# EAGLE design Touch.Cat.0.3 (EAGLE 9.3.1)
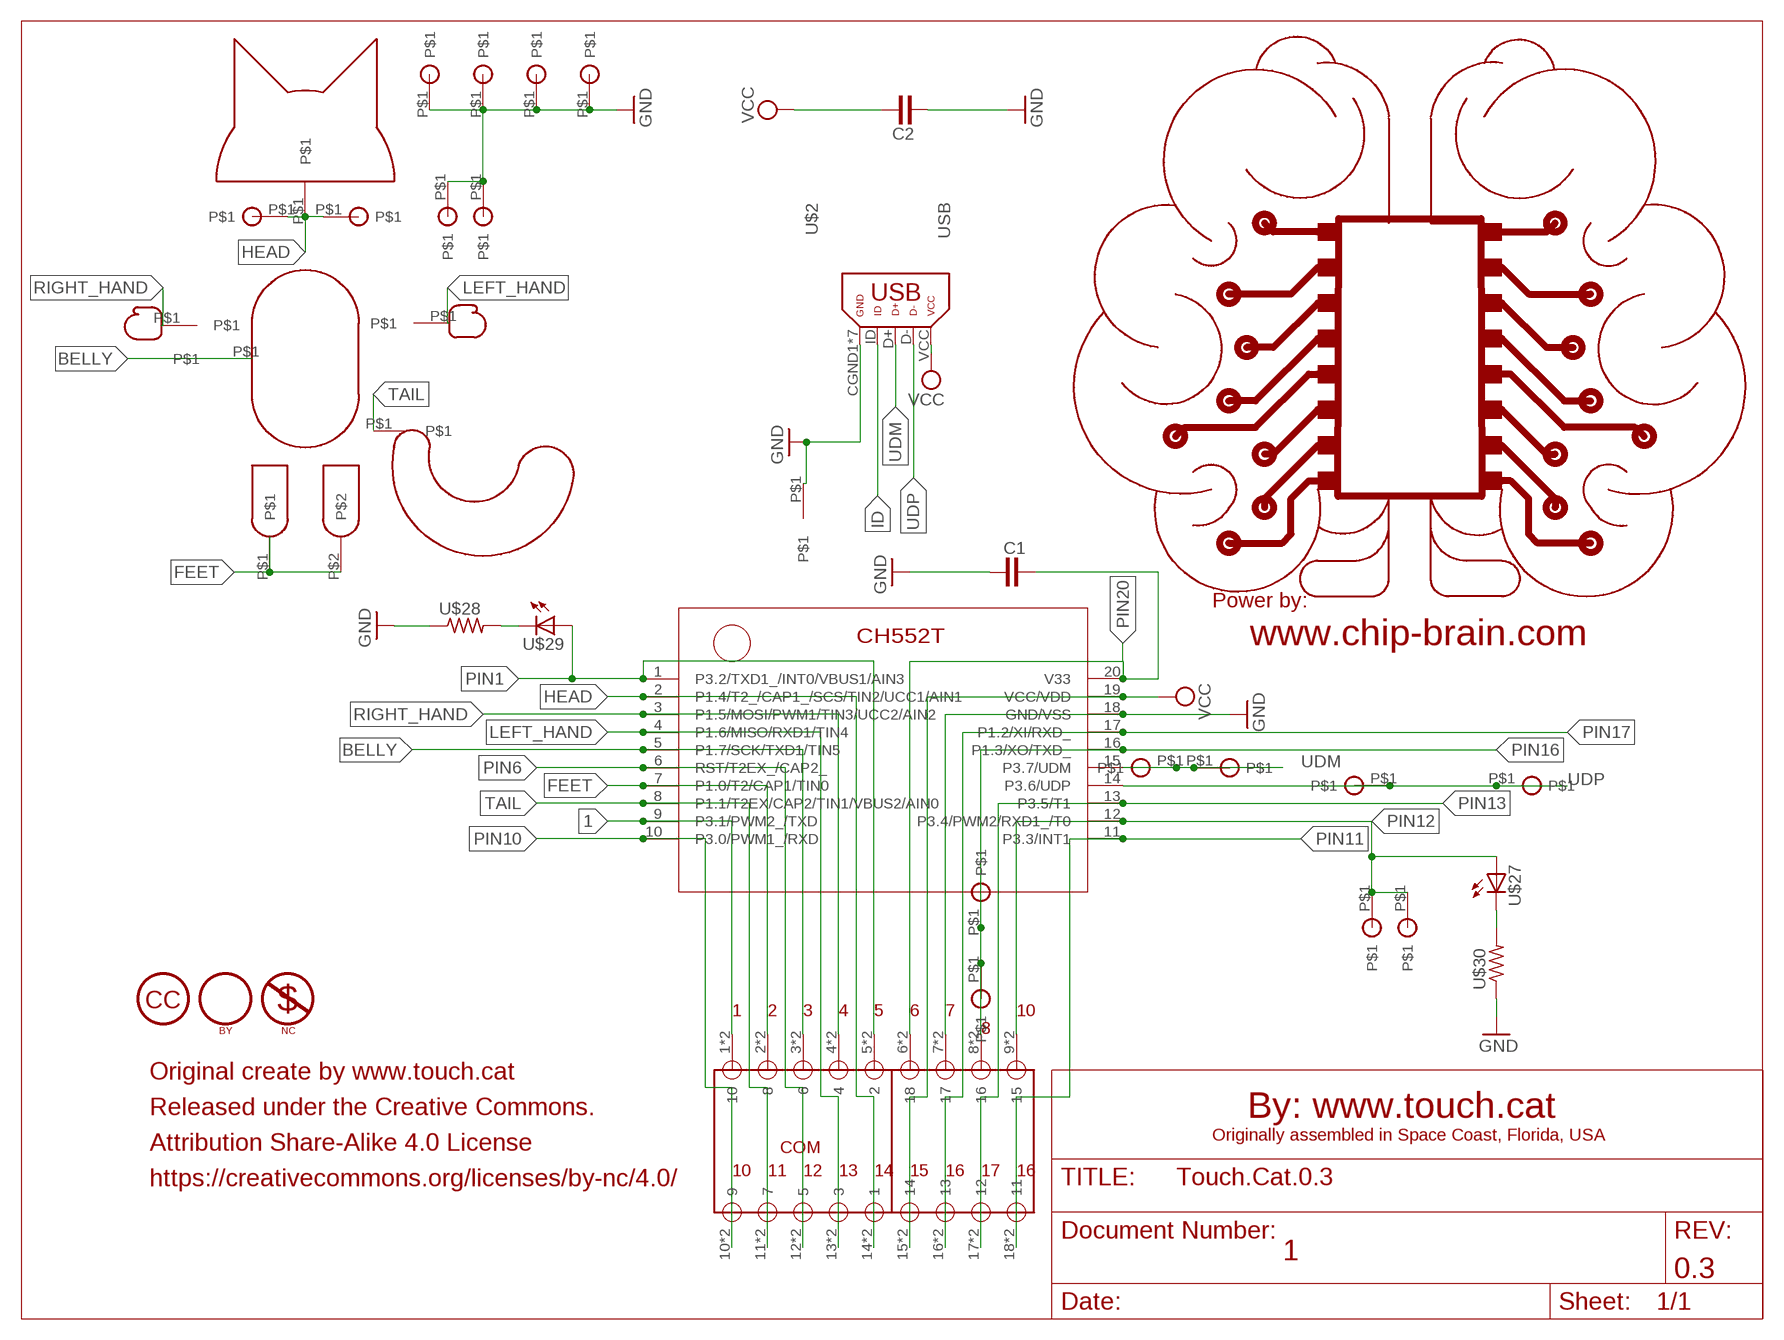
[diagram p0: schematic, sheet 1]

## Parts
C1  CAPACITOR  [C0402]
C2  CAPACITOR  [C0402]
U$1  CHIP-TOUCH-CAT  [TSSOP20]
U$2  USB  [GHI-CONNECTORS_10118192-0001LF(MICRO-USB-B-AMPHENOL-FCI)]
U$3  PADVIA  [PADVIA]
U$4  COM-TOUCH-CAT  [COM]
U$5  PADVIA  [PADVIA]
U$6  PADVIA  [PADVIA]
U$7  PADVIA  [PADVIA]
U$8  PADVIA  [PADVIA]
U$9  PADVIA  [PADVIA]
U$11  PADVIA  [PADVIA]
U$12  PADVIA  [PADVIA]
U$13  PADVIA  [PADVIA]
U$14  PADVIA  [PADVIA]
U$15  PADVIA  [PADVIA]
U$16  PADVIA  [PADVIA]
U$17  HEAD-TOUCH-CAT  [HEAD-TOUCH-CAT]
U$18  BELLY-TOUCH-CAT  [BELLY-TOUCH-CAT]
U$19  RIGHT_HAND-TOUCH-CAT  [RIGHT_HAND-TOUCH-CAT]
U$20  LEFT_HAND-TOUCH-CAT  [LEFT_HAND-TOUCH-CAT]
U$21  FEET-TOUCH-CAT  [FEET-TOUCH-CAT]
U$22  TAIL-TOUCH-CAT  [TAIL-TOUCH-CAT]
U$23  PADVIA  [PADVIA]
U$24  PADVIA  [PADVIA]
U$25  PADVIA  [PADVIA]
U$26  PADVIA  [PADVIA]
U$27  LED-TOUCH-CAT  [0603-ORANGE]
U$28  RESISTOR-TOUCH-CAT  [R0402]
U$29  LED-TOUCH-CAT  [0603-ORANGE]
U$30  RESISTOR-TOUCH-CAT  [R0402]
U$31  OSHW-LOGO  [OSHW-LOGO-MINI]
U$32  CHIP-BRAIN  [CHIP-BRAIN]

## Nets
1: U$1.9(P3.1/PWM2_/TXD) U$4.1 U$4.1.1
BELLY: U$1.5(P1.7/SCK/TXD1/TIN5) U$4.3 U$4.3.1 U$18.P$1
FEET: U$1.7(P1.0/T2/CAP1/TIN0) U$4.2 U$4.2.1 U$21.P$1 U$21.P$2
GND: C1.1 C2.1 U$1.18(GND/VSS) U$2.CGND1(GND) U$2.CGND2(GND) U$2.CGND3(GND) U$2.CGND4(GND) U$2.CGND5(GND) U$2.CGND6(GND) U$2.GND U$4.7 U$4.7.1 U$6.P$1 U$7.P$1 U$23.P$1 U$24.P$1 U$25.P$1 U$26.P$1 U$28.1 U$30.1 U$31.P$1
HEAD: U$1.2(P1.4/T2_/CAP1_/SCS/TIN2/UCC1/AIN1) U$4.14 U$4.14.1 U$8.P$1 U$9.P$1 U$17.P$1
ID: U$2.ID
LEFT_HAND: U$1.4(P1.6/MISO/RXD1/TIN4) U$4.13 U$4.13.1 U$20.P$1
N$2: U$27.C U$30.2
N$19: U$28.2 U$29.C
PIN1: U$1.1(P3.2/TXD1_/INT0/VBUS1/AIN3) U$4.5 U$4.5.1 U$29.A
PIN6: U$1.6(RST/T2EX_/CAP2_) U$4.12 U$4.12.1
PIN10: U$1.10(P3.0/PWM1_/RXD) U$4.10 U$4.10.1
PIN11: U$1.11(P3.3/INT1) U$4.18 U$4.18.1
PIN12: U$1.12(P3.4/PWM2/RXD1_/T0) U$3.P$1 U$4.9 U$4.9.1 U$5.P$1 U$27.A
PIN13: U$1.13(P3.5/T1) U$4.17 U$4.17.1
PIN16: U$1.16(P1.3/XO/TXD_) U$4.8 U$4.8.1 U$11.P$1 U$12.P$1
PIN17: U$1.17(P1.2/XI/RXD_) U$4.16 U$4.16.1
PIN20: C1.2 U$1.20(V33) U$4.6 U$4.6.1
RIGHT_HAND: U$1.3(P1.5/MOSI/PWM1/TIN3/UCC2/AIN2) U$4.4 U$4.4.1 U$19.P$1
TAIL: U$1.8(P1.1/T2EX/CAP2/TIN1/VBUS2/AIN0) U$4.11 U$4.11.1 U$22.P$1
UDM: U$1.15(P3.7/UDM) U$2.D+ U$13.P$1 U$14.P$1
UDP: U$1.14(P3.6/UDP) U$2.D- U$15.P$1 U$16.P$1
VCC: C2.2 U$1.19(VCC/VDD) U$2.VCC U$4.15 U$4.15.1

## Notes on the sheet
- Power by:
- CC | 🕴 | $
- 1 | 2 | 3 | 4 | 5 | 6 | 7 | 10
- BY | NC | 8
- Original create by www.touch.cat
- Released under the Creative Commons. | By: www.touch.cat | 🚀
- Originally assembled in Space Coast, Florida, USA | 🏝
- Attribution Share-Alike 4.0 License
- 10 | 11 | 12 | 13 | 14 | 15 | 16 | 17 | 16
- https://creativecommons.org/licenses/by-nc/4.0/
- 1
- 0.3

## Library data of the parts
C1 C2 = Touch:CAPACITOR
U$1 = Touch-cat:CHIP-TOUCH-CAT: Copyrights: www.chip-brain.com If modified stay original creator www.chip-brain.com
U$2 = chip-brain:USB: chip-brain.com Copyrights: chip-brain.com If modified stay original creator chip-brain.com
U$3 U$5-U$9 U$11-U$16 U$23-U$26 = Touch-cat:PADVIA: PAD VIA - Touch Cat Copyrights: www.touch.cat If modified stay original creator www.touch.cat
U$4 = Touch-cat:COM-TOUCH-CAT: COM - Touch Cat Copyrights: www.touch.cat If modified stay original creator www.touch.cat
U$17 = Touch-cat:HEAD-TOUCH-CAT: Head - Touch Cat Copyrights: www.touch.cat If modified stay original creator www.touch.cat
U$18 = Touch-cat:BELLY-TOUCH-CAT: Belly - Touch Cat Copyrights: www.touch.cat If modified stay original creator www.touch.cat
U$19 = Touch-cat:RIGHT_HAND-TOUCH-CAT: Right Hand - Touch Cat Copyrights: www.touch.cat If modified stay original creator www.touch.cat
U$20 = Touch-cat:LEFT_HAND-TOUCH-CAT: Left Hand - Touch Cat Copyrights: www.touch.cat If modified stay original creator www.touch.cat
U$21 = Touch-cat:FEET-TOUCH-CAT: Feet - Touch Cat Copyrights: www.touch.cat If modified stay original creator www.touch.cat
U$22 = Touch-cat:TAIL-TOUCH-CAT: TAIL - Touch Cat Copyrights: www.touch.cat If modified stay original creator www.touch.cat
U$27 U$29 = Touch-cat:LED-TOUCH-CAT: Led - Touch Cat Copyrights: www.touch.cat If modified stay original creator www.touch.cat
U$28 U$30 = Touch-cat:RESISTOR-TOUCH-CAT: Resistor - Touch Cat Copyrights: www.touch.cat If modified stay original creator www.touch.cat
U$31 = chip-brain:OSHW-LOGO
U$32 = chip-brain:CHIP-BRAIN: chip-brain.com Copyrights: chip-brain.com If modified stay original creator chip-brain.com

## Board
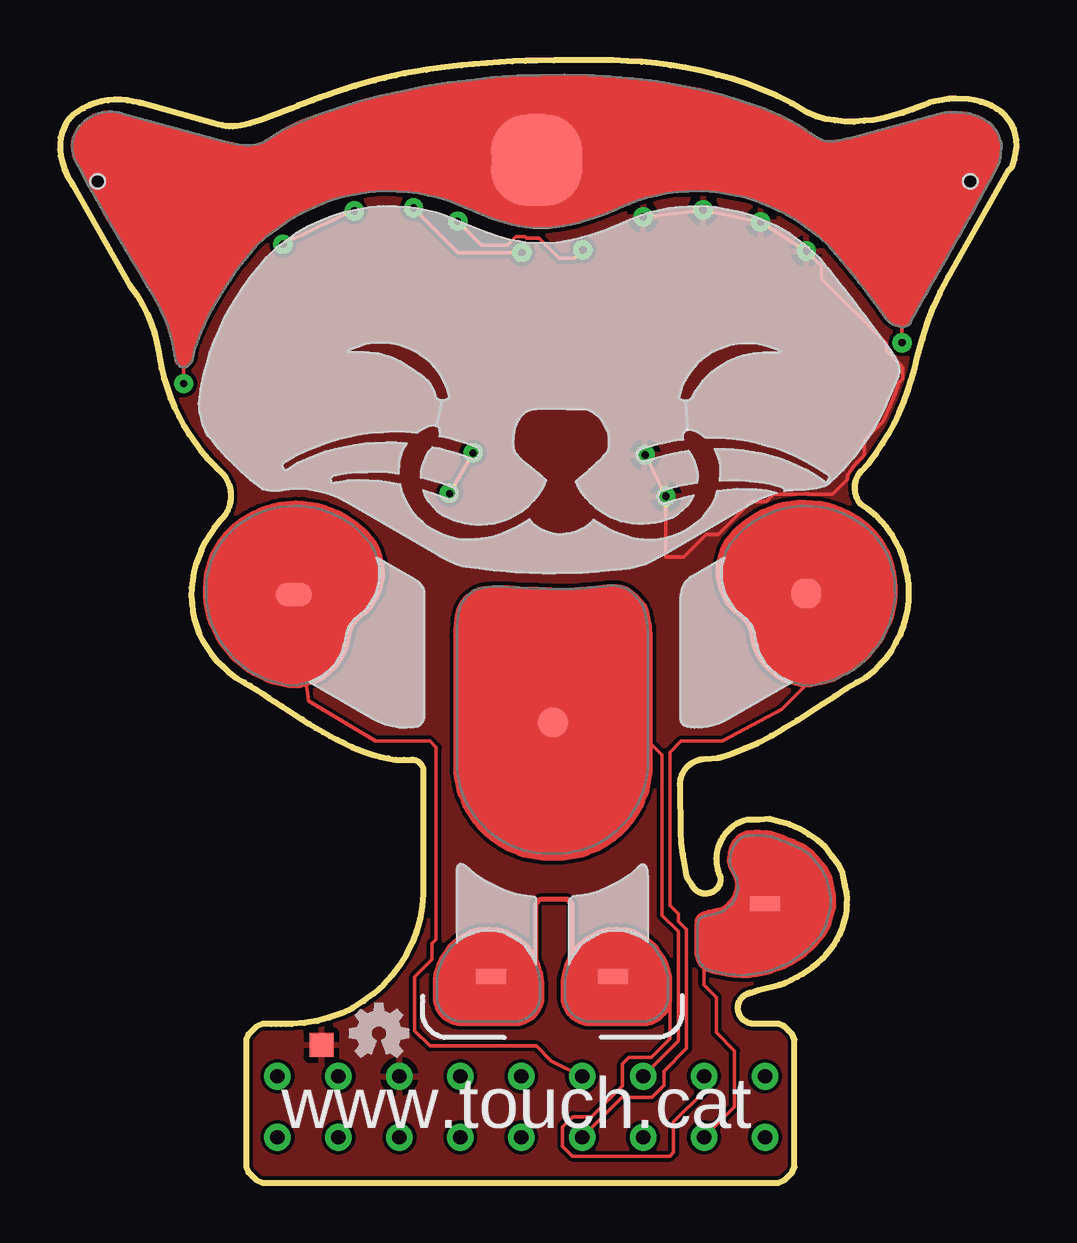
[diagram p1: board, top side]
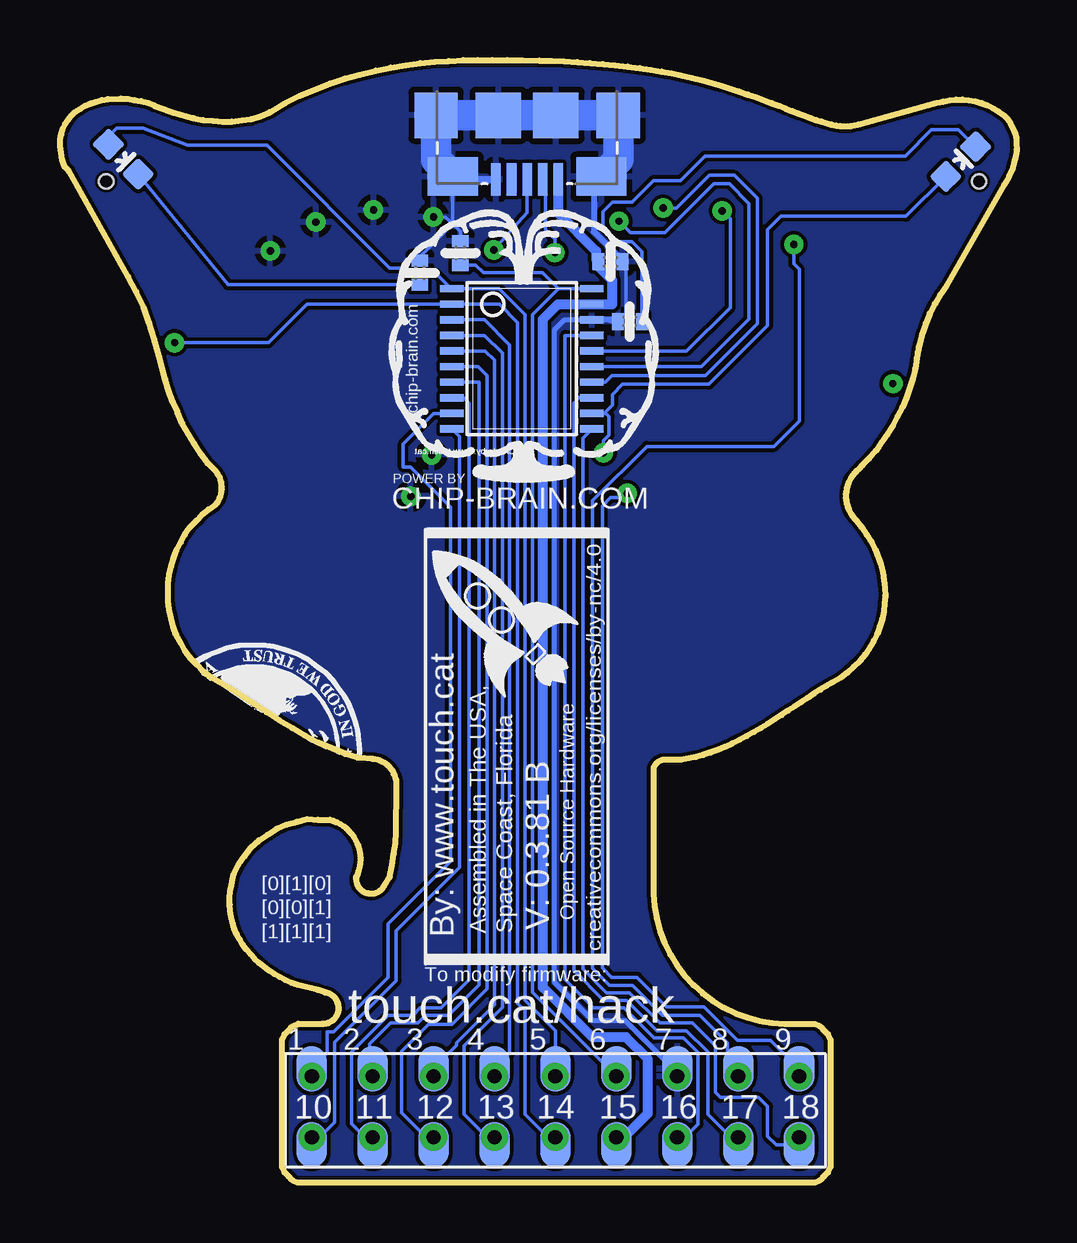
[diagram p2: board, bottom side, seen from below]

Size 39.88 x 46.8 mm. Coordinates in mm from the lower left corner, seen from the top.
Outline: 9.67,6.62 9.43,6.62 9.21,6.61 8.99,6.61 8.8,6.61 8.42,6.61 8.19,6.51 8.03,6.35 7.86,6.19 7.76,5.96 7.76,0.65 7.86,0.43 8.03,0.26 8.19,0.1 8.42,0 29.97,0 30.2,0.1 30.36,0.26 30.52,0.43 30.62,0.65 30.62,5.96 30.52,6.19 30.36,6.35 30.2,6.51 29.94,6.63 28.94,6.63 arc-176 28.84,7.93 29.14,8.03 29.99,8.25 30.24,8.34 30.49,8.44 30.72,8.57 30.95,8.7 31.17,8.84 31.38,9 31.59,9.16 31.78,9.33 31.94,9.53 32.11,9.72 32.26,9.92 32.39,10.14 32.51,10.36 32.61,10.59 32.69,10.83 32.76,11.07 32.8,11.33 32.81,11.6 32.81,11.86 32.79,12.14 32.73,12.42 32.63,12.86 32.44,13.26 32.18,13.61 31.92,13.97 31.59,14.27 31.21,14.51 30.84,14.75 30.43,14.93 30,15.04 29.57,15.16 29.14,15.13 28.64,15.13 arc102 27.54,12.73 arc-162 26.34,12.43 26.14,12.73 26.05,13.23 25.97,13.69 25.9,14.14 25.88,14.62 25.86,16.49 arc-92 26.84,17.65 27.44,17.71 27.98,17.87 28.54,18.1 29.1,18.33 29.65,18.63 30.2,18.95 30.74,19.27 31.27,19.61 31.78,19.94 32.28,20.27 32.77,20.59 33.22,20.85 33.59,21.06 33.91,21.31 34.18,21.59 34.45,21.87 34.68,22.18 34.85,22.51 35.03,22.83 35.16,23.18 35.25,23.53 35.34,23.89 35.38,24.25 35.38,24.61 35.38,24.97 35.33,25.33 35.24,25.68 35.15,26.03 35.02,26.37 34.85,26.69 34.68,27.01 34.47,27.31 34.21,27.58 33.96,27.85 33.69,28.06 33.39,28.27 arc-79 33.38,29.65 33.73,29.99 34.02,30.39 34.28,30.8 34.55,31.21 34.78,31.65 34.98,32.09 35.18,32.55 35.35,33.01 35.49,33.48 35.63,33.95 35.74,34.43 35.95,35.16 arc-15 37.03,37.75 39.53,42.17 39.69,42.35 39.79,42.65 39.84,42.93 39.88,43.21 39.87,43.46 39.82,43.69 39.77,43.92 39.67,44.13 39.54,44.3 39.4,44.48 39.24,44.63 39.04,44.76 38.84,44.88 38.62,44.98 38.38,45.05 38.13,45.12 37.87,45.16 37.33,45.19 37.06,45.17 36.78,45.13 36.5,45.08 36.22,45.01 35.95,44.9 35.55,44.74 35.14,44.6 34.33,44.38 33.92,44.3 33.52,44.26 33.11,44.22 32.71,44.23 32.31,44.28 31.91,44.34 31.51,44.45 31.12,44.62 30.51,44.99 29.89,45.3 28.64,45.81 28.01,46.02 27.38,46.18 26.71,46.35 26.08,46.48 25.47,46.57 24.85,46.66 24.26,46.72 23.66,46.75 23.07,46.79 22.47,46.8 21.85,46.79 21.23,46.79 20.59,46.78 19.91,46.77 19.39,46.76 18.86,46.74 18.32,46.71 17.79,46.67 17.25,46.63 16.74,46.57 16.22,46.52 15.72,46.46 15.26,46.38 14.8,46.31 14.37,46.24 14.01,46.15 13.55,46.05 13.12,45.94 12.31,45.71 11.92,45.59 11.56,45.48 11.2,45.36 10.86,45.23 10.54,45.12 10.22,45 9.92,44.88 9.63,44.77 9.35,44.67 9.09,44.56 8.84,44.47 8.59,44.38 8.36,44.3 8.14,44.23 7.92,44.16 7.72,44.1 7.52,44.06 arc-27 6.62,44.11 3.34,45.01 3.07,45.07 arc52 0.53,44.49 0.39,44.35 0.26,44.18 0.08,43.78 0.03,43.56 0.01,43.31 0,43.06 0.03,42.79 0.11,42.5 0.19,42.22 0.33,41.91 0.53,41.59 2.93,37.38 arc-21 3.94,35.39 4.08,34.83 4.12,34.61 4.16,34.37 4.23,33.93 4.34,33.51 4.61,32.7 4.77,32.31 4.97,31.93 5.16,31.56 5.38,31.2 5.63,30.85 5.88,30.5 6.15,30.18 6.43,29.91 6.58,29.75 arc-99 6.67,27.59 6.45,27.31 6.25,27 6.05,26.71 5.9,26.4 5.66,25.76 5.58,25.44 5.53,25.11 5.49,24.79 5.48,24.46 5.51,24.14 5.54,23.81 5.6,23.49 5.71,23.19 5.81,22.88 5.95,22.58 6.31,22.02 6.53,21.75 6.79,21.51 7.05,21.27 7.34,21.04 7.68,20.85 7.93,20.71 8.18,20.55 8.45,20.38 8.71,20.21 8.98,20.03 9.25,19.85 9.53,19.67 9.81,19.49 10.09,19.31 10.38,19.13 10.67,18.95 10.96,18.78 11.26,18.61 11.56,18.45 11.86,18.31 12.16,18.17 12.46,18.04 12.77,17.93 13.07,17.83 13.38,17.74 13.68,17.69 13.99,17.63 14.34,17.63 14.64,17.63 arc-76 15.14,17.28 15.14,12.05 arc-87 9.67,6.62
Copper layers (1*16): Top 0.035mm / dielectric 1.5mm / Bottom 0.035mm
Design rules "default *": minimum track width 6mil, minimum drill 0.35mm, track to track 6mil, track to pad 6mil, pad to pad 6mil, via to via 6mil, smd to smd 6mil, copper to edge 6mil, drill to drill 6mil, minimum pad ring 10mil, minimum via ring 8mil, stop-mask expansion 4mil, vias tented up to drill 0mil, thermal gap 10mil
Holes 0.6 mm at 1.57,41.74 37.95,41.74

### Footprints (pad centres in the part's own frame; a part is rotated, then mirrored left to right if it is on the bottom)
C0402 = smd 0.5 x 0.7: 1 -0.5,0; 2 0.5,0
TSSOP20 = smd 0.305 x 0.991: 1 -2.925,-2.918; 2 -2.275,-2.918; 3 -1.625,-2.918; 4 -0.975,-2.918; 5 -0.325,-2.918; 6 0.325,-2.918; 7 0.975,-2.918; 8 1.625,-2.918; 9 2.275,-2.918; 10 2.925,-2.918; 11 2.925,2.918; 12 2.275,2.918; 13 1.625,2.918; 14 0.975,2.918; 15 0.325,2.918; 16 -0.325,2.918; 17 -0.975,2.918; 18 -1.625,2.918; 19 -2.275,2.918; 20 -2.925,2.918
GHI-CONNECTORS_10118192-0001LF(MICRO-USB-B-AMPHENOL-FCI) = smd 1.8 x 1.9: CGND1 -3.8,0; CGND4 3.8,0 | smd 1.9 x 1.9: CGND2 -1.2,0; CGND3 1.2,0 | smd 2.1 x 1.6: CGND5 3.1,2.55; CGND6 -3.1,2.55 | smd 0.4 x 1.35: D+ 0,2.675; D- -0.65,2.675; GND 1.3,2.675; ID 0.65,2.675; VCC -1.3,2.675
PADVIA = drill 0.3: P$1 0,0
COM = drill 0.6: 1 8.89,1.27; 2 6.35,1.27; 3 3.81,1.27; 4 1.27,1.27; 5 -1.27,1.27; 6 -3.81,1.27; 7 -6.35,1.27; 8 -8.89,1.27; 9 -11.43,1.27; 10 8.89,-1.27; 11 6.35,-1.27; 12 3.81,-1.27; 13 1.27,-1.27; 14 -1.27,-1.27; 15 -3.81,-1.27; 16 -6.35,-1.27; 17 -8.89,-1.27; 18 -11.43,-1.27 | smd 1.27 x 1.905 bottom: 1.1 8.89,1.587; 2.1 6.35,1.587; 3.1 3.81,1.587; 4.1 1.27,1.587; 5.1 -1.27,1.587; 6.1 -3.81,1.587; 7.1 -6.35,1.587; 8.1 -8.89,1.587; 9.1 -11.43,1.587; 10.1 8.89,-1.587; 11.1 6.35,-1.587; 12.1 3.81,-1.587; 13.1 1.27,-1.587; 14.1 -1.27,-1.587; 15.1 -3.81,-1.587; 16.1 -6.35,-1.587; 17.1 -8.89,-1.587; 18.1 -11.43,-1.587
HEAD-TOUCH-CAT = smd 3.81 x 3.81: P$1 0,0
BELLY-TOUCH-CAT = smd 1.27 x 1.27: P$1 0,0
RIGHT_HAND-TOUCH-CAT = smd 1.5 x 1: P$1 0,0
LEFT_HAND-TOUCH-CAT = smd 1.27 x 1.27: P$1 0,0
FEET-TOUCH-CAT = smd 1.27 x 0.635: P$1 -2.54,0; P$2 2.54,0
TAIL-TOUCH-CAT = smd 1.27 x 0.635: P$1 0,0
0603-ORANGE = smd 1 x 1: A 0,-0.877; C 0,0.877
R0402 = smd 0.5 x 0.7: 1 -0.5,0; 2 0.5,0
OSHW-LOGO-MINI = smd 1 x 1: P$1 -2.4,-0.5

### Placement (x,y rotation side)
C1  23.19,38.75 270 bottom
C2  16.94,38.39 180 bottom
U$1  20.63,34.34 270 bottom
U$2  20.41,44.49 180 bottom
U$3  16.24,28.73 0 top
U$4  20.5,3.16 0 top
U$5  17.22,30.42 0 top
U$6  25.26,28.61 0 top
U$7  24.39,30.34 0 top
U$8  5.16,33.31 0 top
U$9  35.1,35.01 0 top
U$11  9.29,39.11 0 top
U$12  12.27,40.51 0 top
U$13  21.8,38.88 0 top
U$14  16.58,40.08 0 top
U$15  14.74,40.63 0 top
U$16  19.25,38.77 0 top
U$17  19.87,42.63 0 top
U$18  20.55,19.19 0 top
U$19  9.76,24.52 0 top
U$20  31.12,24.56 0 top
U$21  20.53,8.6 0 top
U$22  29.4,11.62 0 top
U$23  24.31,40.25 0 top
U$24  26.81,40.55 0 top
U$25  29.21,40.04 0 top
U$26  31.11,38.84 0 top
U$27  2.33,42.56 315 bottom
U$28  24.88,37.93 270 bottom
U$29  37.24,42.66 225 bottom
U$30  16.13,35.9 0 bottom
U$31  13.3,6.24 0 top
U$32  20.54,34.83 0 bottom

### Tracks (layer width: path | path; a pad name or v marks a point on that pad's centre or on a via)
1
  Bottom 0.152: U$1.9 23.56,32.05 24.31,32.05 25.58,30.78 25.58,29.83 25.26,29.83 23.6,28.17 23.6,13.4 26.21,10.78 26.21,8.55 28.48,6.28 28.75,6.28 28.75,5.38 U$4.1.1 U$4.1
BELLY
  Top 0.152: U$18.P$1 20.58,19.16 23.77,19.16 25.09,17.83 25.09,11.15 25.78,10.47 25.78,5.9 U$4.3
  Bottom 0.152: U$1.5 22.16,34.67 21.77,34.28 21.77,7.4 23.34,5.83 23.34,5.71 U$4.3.1 U$4.3
FEET
  Top 0.152: U$4.2 26.85,3.8 25.58,2.53 25.58,1.26 25.43,1.11 21.37,1.11 20.96,1.52 20.96,2.33 21.38,2.75 22.15,2.75 23.45,4.05 23.45,4.95 23.72,5.21 24.66,5.21 25.44,5.99 25.44,7.59 24.44,8.59 U$21.P$2 | 23.41,8.26 U$21.P$2 | U$21.P$2
  Top 0.203: U$21.P$1 19.11,8.6 19.84,9.33 19.84,11.63 20.04,11.83 21.14,11.83 21.34,11.63 21.34,8.53 21.44,8.43 22.9,8.43 U$21.P$2
  Bottom 0.152: U$1.7 22.4,33.37 22.4,8.24 23.67,6.97 24.64,6.97 24.95,6.66 26.1,6.66 26.97,5.78 26.97,4.56 U$4.2 U$4.2.1
GND
  Top 0.152: U$23.P$1 U$24.P$1 U$25.P$1 U$26.P$1 31.75,38.2 31.75,37.69 34.44,35 34.44,34.69 35.13,34 35.13,33.5 34.95,33.32 34.95,33.26 34.76,32.74 34.29,31.7 33.54,30.95 33.54,30.34 33.51,30.3 33.2,29.99 33.11,29.89 33.02,29.8 32.87,29.53 32.82,29.47 32.82,29.31 32.22,28.71 29.77,28.71 29.45,28.39 28.82,28.39 27.45,27.02 26.94,27.02 26.01,26.09 25.26,26.09 U$6.P$1 U$7.P$1
  Bottom 0.152: 16.45,38.39 C2.1 16.3,38.25 16.3,36.23 U$30.1 16.92,35.9 16.99,35.97 | 17.63,41.62 U$2.CGND6 | U$2.CGND5 23.51,39.96 | U$28.1 24.88,38.58 23.51,39.96 | C1.1 23.19,39.64 23.51,39.96 | 23.51,39.96 23.8,40.25 U$23.P$1 | 16.27,42.98 16.61,42.64
  Bottom 0.203: U$1.18 18.84,35.97 19.26,35.55 19.26,8.35 17.66,6.75 16.3,6.75 14.23,4.67
  Bottom 0.254: U$4.7.1 14.23,4.67 | 17.63,41.62 17.63,39.64 16.44,38.45 C2.1 | 16.74,35.97 16.99,35.97 U$1.18
  Bottom 0.305: U$2.GND 23.38,41.81 U$2.CGND5
  Bottom 1.27: U$2.CGND6 16.61,42.64 U$2.CGND1 U$2.CGND2 U$2.CGND3 U$2.CGND4 24.21,42.64 U$2.CGND5
  pour Bottom: 1.91,36.92 -1.49,40.32 -1.49,46.94 11.23,46.94 11.65,47.36 30.4,47.36 32.53,45.23 34.87,45.23 36.15,46.51 39.2,46.51 40.98,44.73 40.98,40.97 37.71,37.7 37.71,32.5 35.08,29.87 35.08,29.01 37.28,26.81 37.28,23.32 31.6,17.64 29.76,17.64 28.55,16.43 27.13,16.43 27.13,15.57 27.2,15.5 27.27,15.57 31.96,15.57 33.38,14.15 33.38,10.17 30.68,7.47 31.53,6.62 31.53,-0.29 30.84,-0.98 6.12,-0.98 6.12,7.48 7.46,8.82 11.64,8.82 13.42,10.6 13.42,16.21 10.16,16.21 2.7,23.67 2.7,26.47 5.32,29.09 1.91,32.5
  pour Top: -1.09,45.71 -1.09,39.36 2.72,35.55 2.72,33.01 5.26,30.47 5.26,29.2 3.99,27.93 3.99,22.85 10.34,16.5 11.61,16.5 12.88,15.23 12.88,10.15 10.34,7.61 7.8,7.61 6.53,6.34 6.53,1.26 7.8,-0.01 7.8,-1.28 31.93,-1.28 31.93,7.61 35.74,11.42 35.74,13.96 33.2,16.5 29.39,16.5 30.66,17.77 33.2,17.77 37.01,21.58 37.01,26.66 35.74,27.93 35.74,29.2 38.28,31.74 38.28,36.82 42.09,40.63 42.09,44.44 39.55,46.98 35.74,46.98 34.47,45.71 31.93,45.71 29.39,48.25 10.34,48.25 7.8,45.71 6.53,45.71 5.26,46.98 0.18,46.98
HEAD
  Top 0.152: U$9.P$1 35.1,41.26 33.74,42.63 U$17.P$1 8.53,42.63 5.16,39.26 U$8.P$1
  Bottom 0.152: U$9.P$1 31.19,35.01 29.59,36.62 U$1.2 21.57,36.62 20.8,35.85 20.8,7.48 20.5,7.18 20.5,2.85 U$4.14.1 U$4.14
LEFT_HAND
  Top 0.152: U$4.13 23.43,3.56 24.67,3.56 25.18,4.07 25.18,4.65 26.12,5.59 26.12,10.56 25.79,10.89 25.79,11.21 25.43,11.56 25.43,17.94 25.9,18.4 27.61,18.4 30.07,19.72 31.12,20.77 U$20.P$1
  Bottom 0.152: U$1.4 22.17,35.32 21.44,34.58 21.44,7.3 23.04,5.7 23.04,2.85 U$4.13.1 U$4.13
N$2
  Bottom 0.152: U$30.2 15.63,38.82 16.04,39.23 16.64,39.23 17.25,39.84 17.25,40.48 16.85,40.88 16.03,40.88 15.14,41.77 14.02,41.77 12.99,42.8 4.65,42.8 3.55,43.89 2.42,43.89 U$27.C
N$19
  Bottom 0.152: U$29.C 32.88,37.43 U$28.2
PIN1
  Bottom 0.152: U$1.1 21.58,37.27 20.5,36.18 20.5,7.61 19.23,6.34 U$4.5.1 U$4.5 | 23.61,37.33 U$1.1 | U$1.1 23.58,37.27 24.24,37.93 25.34,37.93 25.54,38.13 26.14,38.13 31.25,43.23 34.55,43.23 36.42,43.95 37.52,43.95 37.86,43.61 U$29.A
PIN6
  Bottom 0.152: U$1.6 22.45,34.02 22.07,33.64 22.07,8.08 23.54,6.61 24.52,6.61 25.65,5.48 25.65,2.91 U$4.12.1 U$4.12
PIN10
  Bottom 0.152: U$1.10 23.23,31.1 23.23,13.13 25.87,10.49 25.87,8.42 28.44,5.84 28.44,2.52 U$4.10.1 U$4.10
PIN11
  Bottom 0.152: U$1.11 18.09,31.04 18.09,8.9 17.1,7.91 16.13,7.91 14.88,6.65 13.51,6.65 12.56,5.7 12.56,3.76 12.36,3.56 10.77,3.56 10.39,3.18 10.39,1.94 10.02,1.57 U$4.18.1 U$4.18
PIN12
  Top 0.152: U$3.P$1 U$5.P$1
  Bottom 0.152: U$5.P$1 17.22,30.93 16.99,31.17 16.99,31.93 17.11,32.06 17.2,32.06 | 17.2,32.06 U$1.12 | U$27.A 4.61,40.28 9.84,40.28 10.39,39.73 10.39,35.73 12.84,33.28 16.44,33.28 16.86,32.86 16.86,32.41 17.2,32.06 | U$3.P$1 16.37,28.59 16.37,28.56 16.92,28.56 17.28,28.21 17.28,8.95 16.88,8.56 15.82,8.56 14.59,7.33 13.04,7.33 11.65,5.94 10.26,5.94 U$4.9.1 U$4.9
PIN13
  Bottom 0.152: U$1.13 18.25,32.72 18.46,32.5 18.46,8.85 17.22,7.61 16.26,7.61 14.99,6.34 13.77,6.34 12.88,5.45 12.88,2.85 U$4.17.1 U$4.17
PIN16
  Top 0.152: U$11.P$1 12.21,40.51 U$12.P$1
  Bottom 0.152: U$11.P$1 9.29,38.31 9.07,38.09 9.07,31.74 10.12,30.69 15.42,30.69 17.68,28.43 17.68,8.93 16.97,8.22 16.01,8.22 14.76,6.97 13.2,6.97 12.06,5.83 12.06,5.2 U$4.8.1 U$4.8 | U$12.P$1 11.94,40.18 11.94,36.48 13.76,34.67 U$1.16
PIN17
  Bottom 0.152: U$1.17 18.82,35.32 18.83,35.31 18.83,8.46 17.64,7.28 16.36,7.28 15.12,6.03 13.89,6.03 13.28,5.43 13.28,2.44 U$4.16.1 U$4.16
PIN20
  Bottom 0.152: C1.2 22.56,38.25 22.23,37.93 19.76,37.93 19.1,37.27 U$1.20 19.11,37.27 20.19,36.18 20.19,7.94 17.01,4.75 U$4.6.1 U$4.6
RIGHT_HAND
  Top 0.152: U$4.4 20.5,5.07 19.86,5.7 15.42,5.7 14.78,6.34 14.78,8.58 15.52,9.31 15.52,9.98 15.68,10.15 15.68,18.14 15.42,18.4 13.16,18.4 10.37,20.08 U$19.P$1
  Bottom 0.152: U$1.3 22.19,35.97 21.13,34.91 21.13,5.38 U$4.4.1 U$4.4
TAIL
  Top 0.152: U$4.11 28.12,3.16 28.12,5.5 27.36,6.26 27.36,7.73 26.85,8.24 26.85,9.07 U$22.P$1
  Bottom 0.152: U$1.8 23.05,32.72 22.82,32.49 22.82,8.46 24,7.28 24.87,7.28 25.17,6.97 26.21,6.97 27.73,5.46 27.73,2.45 U$4.11.1 U$4.11
UDM
  Top 0.152: U$13.P$1 21.45,38.53 20.8,38.53 20.55,38.78 20.55,38.79 19.97,39.37 19.45,39.37 19.39,39.43 19.02,39.43 18.66,39.07 17.58,39.07 U$14.P$1
  Bottom 0.152: U$1.15 13.14,34.02 11.16,36 11.16,40.82 11.98,41.64 12.63,41.64 14.67,39.6 16.1,39.6 U$14.P$1 | U$13.P$1 20.41,40.42 U$2.D+
UDP
  Top 0.152: U$16.P$1 16.6,38.77 U$15.P$1
  Bottom 0.152: 19.86,41.71 U$2.D- 19.64,41.69 19.64,39.73 19.25,39.34 U$16.P$1 | U$1.14 17.14,33.37 16.86,33.65 12.98,33.65 10.81,35.81 10.81,41.03 11.77,41.99 12.82,41.99 14.18,40.63 U$15.P$1
VCC
  Bottom 0.152: U$4.15.1 U$4.15
  Bottom 0.254: 17.54,38.49 C2.2
  Bottom 0.406: U$4.15.1 15.38,2.88 15.38,5.16 16.28,6.06 17.68,6.06 19.75,8.13 19.75,35.99 19.13,36.62 U$1.19 16.86,36.62 16.86,37.61 17.44,38.19 C2.2 | U$2.VCC 19.11,40.41 17.54,38.84 17.54,38.49

### Text on the board
tPlace: www.touch.cat
bPlace: www.touch.cat | POWER BY | creativecommons.org/licenses/by-nc/4.0 | By: www.touch.cat | Assembled in The USA, | Open Source Hardware | Space Coast, Florida | V: 0.3.81 B | [0][1][0] | [0][0][1] | [1][1][1] | To modify firmware: | touch.cat/hack
Reference: By: www.touch.cat | Originally assembled in Space Coast, Florida, USA | Released under the Creative Commons. | Attribution Share-Alike 4.0 License | https://creativecommons.org/licenses/by-nc/4.0/